# Altium schematic sheet CON_SPDIF_OUT.SchDoc: S/PDIF RCA OUT
size A4; Organization: Altium Limited.; Address1: Level 3, 12a Rodborough Rd; Address2: Frenchs Forest 2086; Address3: NSW; Address4: AUSTRALIA; DocumentNumber: 6; SheetNumber: 6; SheetTotal: 100
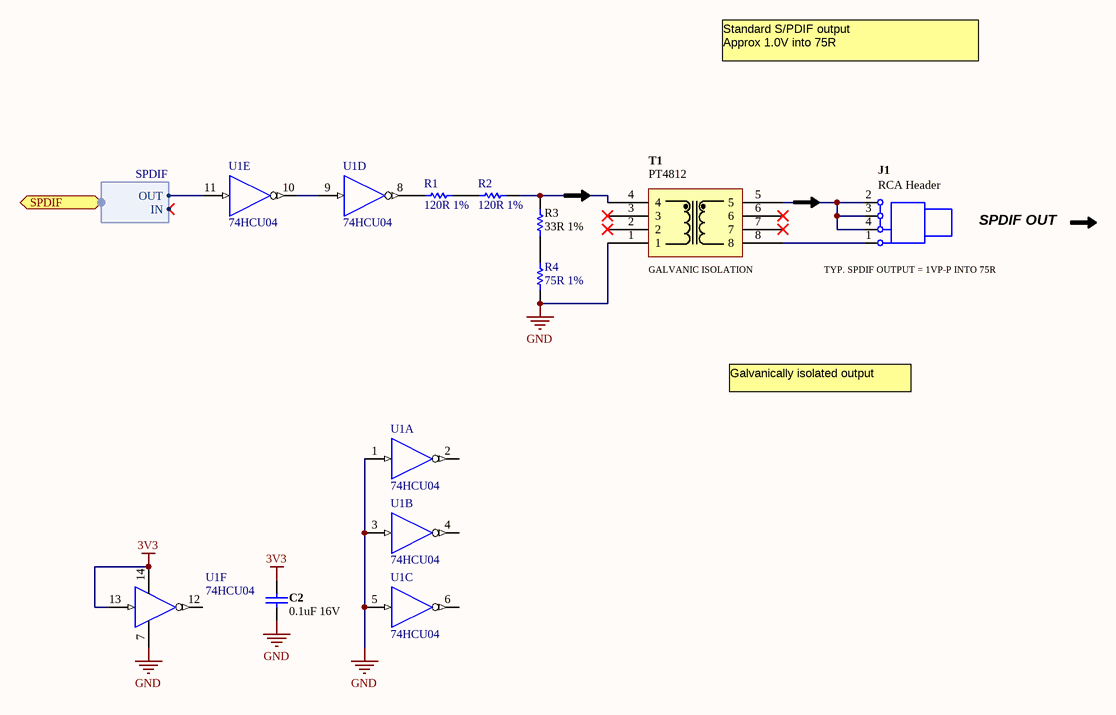
[diagram p0: CON_SPDIF_OUT.SchDoc]

## Parts
C2  0.1uF 16V  [CAPC1005-STAR]
J1  RCA Header  [TRC-005]
R1  120R 1%  [RESC1005-STAR]
R2  120R 1%  [RESC1005-STAR]
R3  33R 1%  [RESC1005-STAR]
R4  75R 1%  [RESC1005-STAR]
T1  PT4812  [PT4812]
U1  74HCU04  [SOIC127P600-14]  (parts A,B,C,D,E,F of 6)

## Ports
SPDIF (harness SPDIF)

## Harnesses
SPDIF: IN, OUT

## Nets
3V3: C2.2 U1.13(A) U1.14(VCC)
GND: C2.1 R4.2 T1.1 U1.1(A) U1.3(A) U1.5(A) U1.7(GND)
NetJ1_1: J1.1(Black) T1.8
NetJ1_2: J1.2(Yellow) J1.3(White) J1.4(Red) T1.5
NetR1_1: R1.1 U1.8(Y)
NetR1_2: R1.2 R2.1
NetR2_2: R2.2 R3.2 T1.4
NetR3_1: R3.1 R4.1
NetU1_9: U1.9(A) U1.10(Y)
NetU1_11: U1.11(A) ; port SPDIF.OUT

Not connected (* = marked no-connect by the designer): T1 2* 3* 6* 7*; U1 2(Y) 4(Y) 6(Y) 12(Y)

## Notes on the sheet
- Standard S/PDIF output
  Approx 1.0V into 75R
- SPDIF OUT
- (near T1) GALVANIC ISOLATION
- (near J1) TYP. SPDIF OUTPUT = 1VP-P INTO 75R
- Galvanically isolated output
- Sheet Title
- Project Title
- Size:
- Date:
- A4
- Assy:
- Time:
- Revision:
- Sheet
- of
- File:

## Library data of the parts
C2 = D-101-0080: Capacitor, Ceramic, 0.1uF 10% 16V 0402 (1005) X7R; Polarity: Non-Polarized; Capacitance: 0.1 uF; Category: Capacitor; Dielectric: X7R; Mounting Technology: Surface Mount; Rated Voltage: 16 V; Status: Production; Technology: Ceramic; Tolerance: 10 %
J1 = D-300-0132: Connector, TRC-005-4 , Black RCA Phono Jack, Right Angle, Thru-Hole, Snap-In; Max Current: mA; Connector type: Header; Mounting Technology: Through-Hole; Status: Unreleased; Category: Connector
R1 R2 = D-100-0126: Resistor, 120R 1% 0402 (1005); Power Rating: 63 mW; Mounting Technology: Surface Mount; Resistance: 120 R; Status: Production; Tolerance: 1 %; Category: Resistor
R3 = D-100-0102: Resistor, 33R 1% 0402 (1005); Power Rating: 63 mW; Mounting Technology: Surface Mount; Resistance: 33 R; Status: Production; Tolerance: 1 %; Category: Resistor
R4 = D-100-0001: Resistor, 75R 1% 0402; Power Rating: 1/16 W; Mounting Technology: Surface Mount; Resistance: 75 R; Status: Production; Tolerance: 1 %; Category: Resistor
T1 = D-107-0004: Transformer, 1:1, SMD, 0 to 70 deg C,  1 to 7 Mbps, 500Vrms min; Status: Unreleased; Category: Transformer
U1 = D-205-0010: 74HCU04, HEX Inverter, Unbuffered; Mounting Technology: Surface Mount; Status: Production; Category: IC-Logic